# Altium project TIDA-010086_mod.PrjPcb (part 11 of 11)
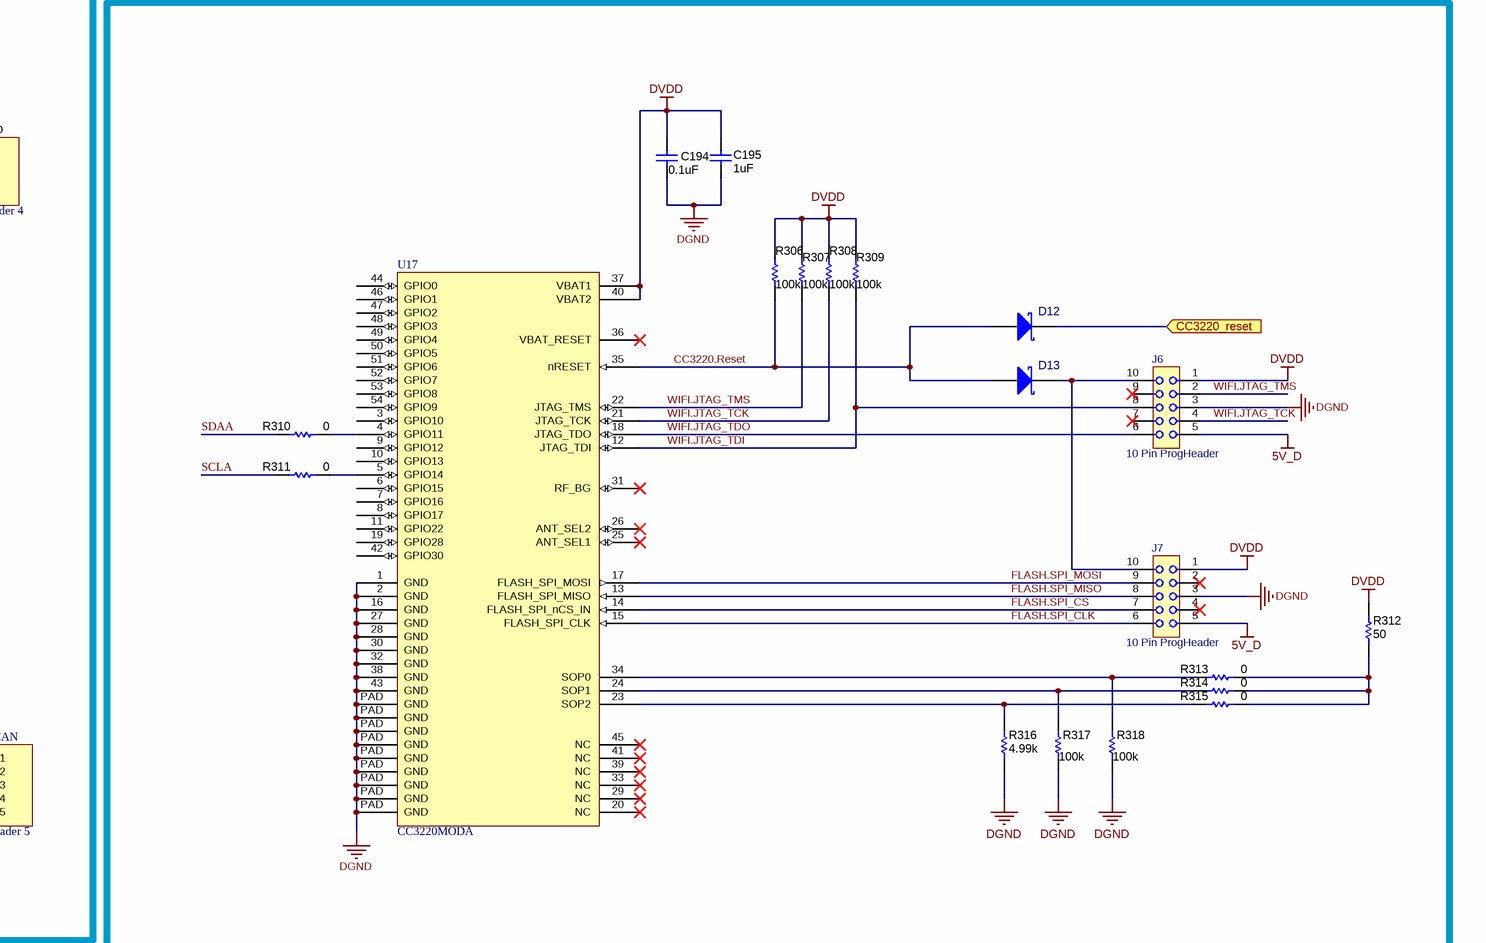
[diagram p119: XTIDA-010086_Control Card_28379.SchDoc, bottom right]

## Sheet XTIDA-010086_CoverSheet.SchDoc: Block diagram
size 431 x 279 mm; Date: Not shown in title block; ApprovedBy: Not shown in title block; CheckedBy: Not shown in title block; Author: Not shown in title block; CompanyName: Not shown in title block; DrawnBy: Jeff Xie; Engineer: Not shown in title block; Organization: Not shown in title block; Address1: Not shown in title block; Address2: Not shown in title block; Address3: Not shown in title block; Address4: Not shown in title block; DocumentNumber: 1; Revision: Use project parameter SCH_Rev; SheetNumber: 1; SheetTotal: 8; PageSetup: Record=PageOptions|CenterHorizontal=True|CenterVertical=True|PrintScale=1.00|XCorrection=1.00|YCorrection=1.00|PrintKind=0|BorderSize=5000000|LeftOffset=0|BottomOffset=0|Orientation=2|PaperLength=1000|PaperWidth=1000|Scale=100|PaperSource=15|PrintQuality=600|MediaType=1|DitherType=10|PaperKind=Letter|PrintScaleMode=1; CurrentTime: Not shown in title block; CurrentDate: Not shown in title block; DocumentFullPathAndName: Not shown in title block; DocumentName: Not shown in title block; ModifiedDate: Not shown in title block; ImagePath: Not shown in title block

### Notes on the sheet
- Drawn By:
- SVN Rev:
- Number:
- TID #:
- Orderable:
- Rev:
- Sheet Title:
- File:
- Project Title:
- Designed for:
- Assembly Variant:
- Mod. Date:
- Sheet:
- Size:
- of
- B
- http://www.ti.com
- Texas Instruments and/or its licensors do not warrant the accuracy or completeness of this specification or any information contained therein. Texas Instruments and/or its licensors do not warrant that this design will meet the specifications, will be suitable for your application or fit for any particular purpose, or will operate in an implementation. Texas Instruments and/or its licensors do not warrant that the design is production worthy. You should completely validate and test your design implementation to confirm the system functionality for your application.
- Engineer:
- Contact:
- © Texas Instruments
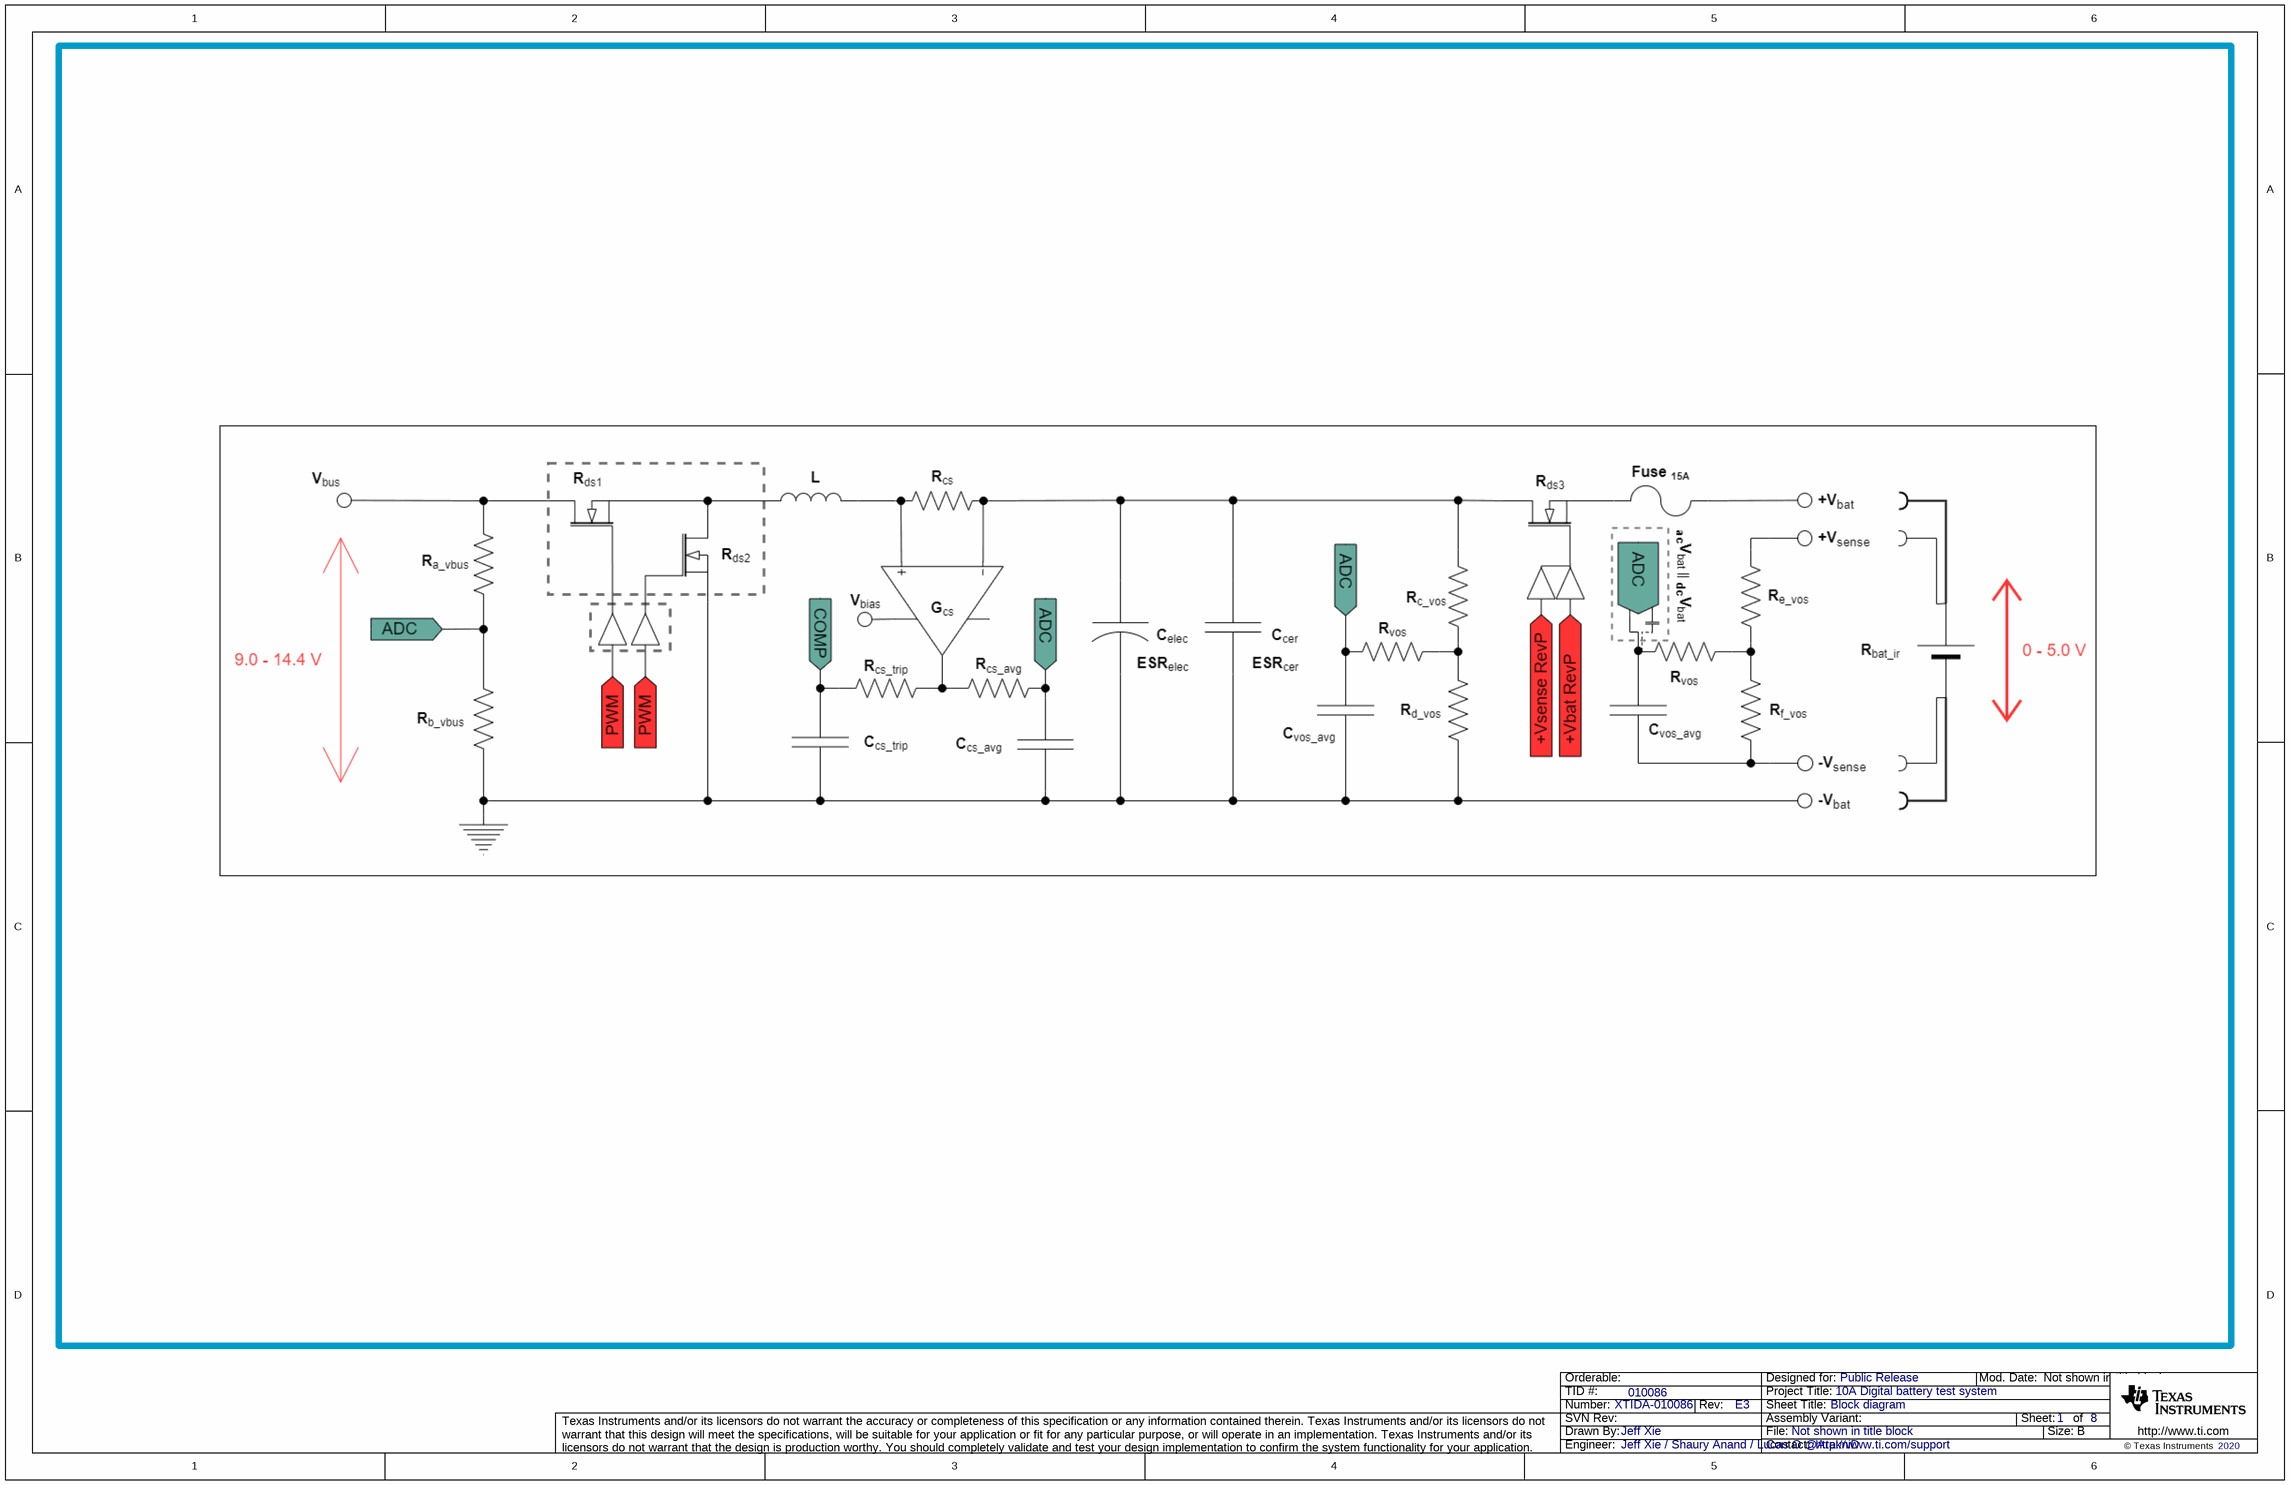
[diagram p18: XTIDA-010086_CoverSheet.SchDoc]

## Sheet XTIDA-010086_Hardware.SchDoc
size 431 x 279 mm; Date: Not shown in title block; ApprovedBy: Not shown in title block; CheckedBy: Not shown in title block; Author: Not shown in title block; CompanyName: Not shown in title block; Engineer: Not shown in title block; Organization: Not shown in title block; Address1: Not shown in title block; Address2: Not shown in title block; Address3: Not shown in title block; Address4: Not shown in title block; DocumentNumber: 3; Revision: Use project parameter SCH_Rev; SheetNumber: 8; SheetTotal: 8; PageSetup: Record=PageOptions|CenterHorizontal=True|CenterVertical=True|PrintScale=1.00|XCorrection=1.00|YCorrection=1.00|PrintKind=0|BorderSize=5000000|LeftOffset=0|BottomOffset=0|Orientation=2|PaperLength=1000|PaperWidth=1000|Scale=100|PaperSource=15|PrintQuality=600|MediaType=1|DitherType=10|PaperKind=Letter|PrintScaleMode=1; CurrentTime: Not shown in title block; CurrentDate: Not shown in title block; Time: Not shown in title block; DocumentFullPathAndName: Not shown in title block; DocumentName: Not shown in title block; ModifiedDate: Not shown in title block; ImagePath: Not shown in title block
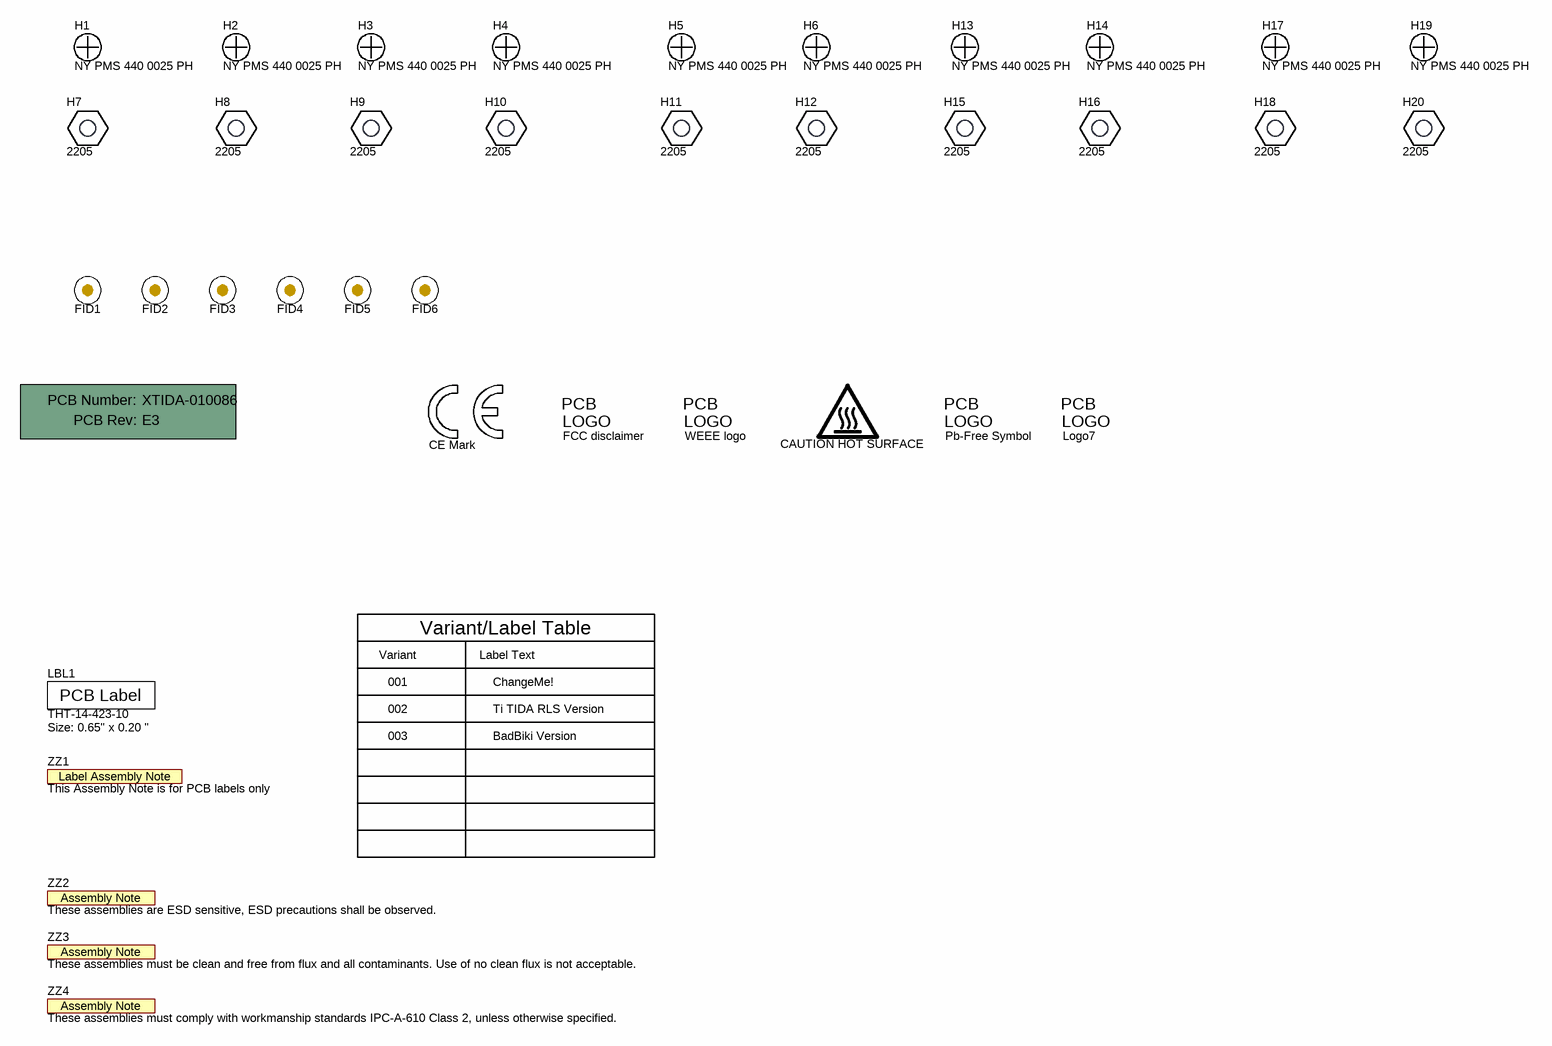
[diagram p19: XTIDA-010086_Hardware.SchDoc]

### Parts
!PCB1  Printed Circuit Board  (value not drawn)  (mechanical)
FID1  Fiducial  [Fiducial10-20]  (value not drawn)
FID2  Fiducial  [Fiducial10-20]  (value not drawn)
FID3  Fiducial  [Fiducial10-20]  (value not drawn)
FID4  Fiducial  [Fiducial10-20]  (value not drawn)
FID5  Fiducial  [Fiducial10-20]  (value not drawn)
FID6  Fiducial  [Fiducial10-20]  (value not drawn)
H1  NY PMS 440 0025 PH  [NY PMS 440 0025 PH]
H2  NY PMS 440 0025 PH  [NY PMS 440 0025 PH]
H3  NY PMS 440 0025 PH  [NY PMS 440 0025 PH]
H4  NY PMS 440 0025 PH  [NY PMS 440 0025 PH]
H5  NY PMS 440 0025 PH  [NY PMS 440 0025 PH]
H6  NY PMS 440 0025 PH  [NY PMS 440 0025 PH]
H7  2205  [KEYSTONE_2205]
H8  2205  [KEYSTONE_2205]
H9  2205  [KEYSTONE_2205]
H10  2205  [KEYSTONE_2205]
H11  2205  [KEYSTONE_2205]
H12  2205  [KEYSTONE_2205]
H13  NY PMS 440 0025 PH  [NY PMS 440 0025 PH]
H14  NY PMS 440 0025 PH  [NY PMS 440 0025 PH]
H15  2205  [KEYSTONE_2205]
H16  2205  [KEYSTONE_2205]
H17  NY PMS 440 0025 PH  [NY PMS 440 0025 PH]
H18  2205  [KEYSTONE_2205]
H19  NY PMS 440 0025 PH  [NY PMS 440 0025 PH]
H20  2205  [KEYSTONE_2205]
LBL1  THT-14-423-10  Note: Size: 0.65" x 0.20 "  [Label_650x200]
Logo1  CE Mark  [CE_Mark_5mm]  (no BOM)
Logo3  FCC disclaimer  [FCC_disclaimer]  (no BOM)
Logo4  WEEE logo  [WEEE_Minimum]  (no BOM)
LOGO5  CAUTION HOT SURFACE  [IEC_HotSurface_Small]  (no BOM)
Logo6  Pb-Free Symbol  [Pb-Free_Overlay_Small]  (no BOM)
Logo7  ESD Susceptible  [ESD_Overlay_Medium]  (value not drawn)  (no BOM)
ZZ1  This Assembly Note is for PCB labels only  [AssemblyNoteLabel]  (no BOM)
ZZ2  These assemblies are ESD sensitive, ESD precautions shall be observed.  [AssemblyNote]  (no BOM)
ZZ3  These assemblies must be clean and free from flux and all contaminants. Use of no clean flux is not acceptable.  [AssemblyNote]  (no BOM)
ZZ4  These assemblies must comply with workmanship standards IPC-A-610 Class 2, unless otherwise specified.  [AssemblyNote]  (no BOM)

### Notes on the sheet
- Variant
- Label Text
- Variant/Label Table
- 001
- 002
- ChangeMe!
- Ti TIDA RLS Version
- 003
- BadBiki Version
- Drawn By:
- SVN Rev:
- Number:
- TID #:
- Orderable:
- Rev:
- Sheet Title:
- File:
- Project Title:
- Designed for:
- Assembly Variant:
- Mod. Date:
- Sheet:
- Size:
- of
- B
- http://www.ti.com
- Texas Instruments and/or its licensors do not warrant the accuracy or completeness of this specification or any information contained therein. Texas Instruments and/or its licensors do not warrant that this design will meet the specifications, will be suitable for your application or fit for any particular purpose, or will operate in an implementation. Texas Instruments and/or its licensors do not warrant that the design is production worthy. You should completely validate and test your design implementation to confirm the system functionality for your application.
- Engineer:
- Contact:
- © Texas Instruments
- (in symbol CMP-0003616-3) Label Assembly Note
- (in symbol CMP-0003618-2) PCB Number:; PCB Rev:
- (in symbol CMP-0003625-1) PCB Label
- (in symbol CMP-0074769-1) PCB; LOGO
- (in symbol CMP-0074847-1) PCB; LOGO
- (in symbol ESD_Susceptible) PCB; LOGO
- (in symbol Pb-Free) PCB; LOGO

### Library data of the parts
!PCB1 = CMP-0003618-2: Manufacturer: Any; PartNumber: XTIDA-010086; CompType: PCB; RoHS: O; MountType: N/A; Publisher: Texas Instruments; LatestRevisionDate: 2017-03-09; Key: PCB
FID1-FID6 = Fiducial: Fiducial mark.  There is nothing to buy or mount.; SymbolCreator: codlsc; SymbolVersion: 2009-11-4; CompType: Fiducial; Publisher: Texas Instruments; LatestRevisionDate: 2014-08-01; LatestRevisionNote: Added Alternate PartNumber and Alternate Manufacturer parameters to appropriate components.; Manufacturer: N/A; MountType: N/A; PackageReference: Fiducial; PartNumber: N/A; ClassName: FiducialMark
H1-H6 H13 H14 H17 H19 = NY PMS 440 0025 PH: Machine Screw, Round, #4-40 x 1/4, Nylon, Philips panhead; Manufacturer: B&F Fastener Supply; CompType: Hardware; SymbolCreator: codlsc; U/M: EA; SymbolVersion: 2009-10-28; MountType: N/A; RoHS: Y; PartNumber: NY PMS 440 0025 PH; PackageReference: Screw; DigiKeyPartNumber: H542-ND; ComponentLink1Description: Datasheet Link; ComponentLink1URL: http://www.fasnetdirect.com/refguide/Machinepancombo.pdf; ClassName: Mounting Holes; Alternate Manufacturer: -; Alternate PartNumber: -; LatestRevisionDate: 2012-06-27; LatestRevisionNote: Initial Version; Publisher: Texas Instruments; Supplier 1: Digi-Key; Supplier Part Number 1: H542-ND
H7-H12 H15 H16 H18 H20 = 2205: Standoff, Hex, 1"L #4-40 Aluminum; Manufacturer: Keystone; SymbolCreator: a0412235; CompType: Standoff; MountType: N/A; RoHS: Y; PartNumber: 2205; PackageReference: 1" Aluminum Hex Standoff; ComponentLink1Description: Datasheet Link; ComponentLink1URL: http://www.keyelco.com/product-pdf.cfm?p=4279; LatestRevisionDate: 2014-11-19; Publisher: Texas Instruments; Supplier 1: Digi-Key; Supplier 2: Mouser; Supplier Part Number 1: 2205K-ND; Supplier Part Number 2: 534-2205; SymbolVersion: 2013-06-24
LBL1 = CMP-0003625-1: Thermal Transfer Printable Labels, 0.650" W x 0.200" H - 10,000 per roll; Manufacturer: Brady; CompType: Label; ClassName: Label; PartNumber: THT-14-423-10; RoHS: Y; PackageReference: PCB Label 0.650 x 0.200 inch; MountType: N/A; ComponentLink1Description: Web Page; ComponentLink1URL: http://www.bradyid.com/bradyid/pdpv/THT-14-423-10.html; Publisher: Texas Instruments; LatestRevisionDate: 2017-03-09; Supplier 1: Newark; Supplier Part Number 1: 97C5133; Supplier 2: Farnell; Supplier Part Number 2: 2065596; Key: THT-14-423-10
Logo1 = CMP-0074844-1: SymbolCreator: a0412235; Published: 2009-03-03; Publisher: Texas Instruments; LatestRevisionDate: 2017-07-06; Lib Reference: CE Mark; PartNumber: CE Mark; Library Reference: CE Mark
Logo3 = CMP-0074847-1: FCC_disclaimer; Library Reference: Logo; Published: 2009-03-03; Publisher: Texas Instruments; LatestRevisionDate: 2017-07-06; Lib Reference: FCC_disclaimer; PartNumber: FCC disclaimer
Logo4 = CMP-0074769-1: Library Reference: WEEE logo; Lib Reference: WEEE logo; PartNumber: WEEE logo
LOGO5 = CMP-0074837-1: IEC 61010-1 Hot Surface Warning; Library Reference: IEC_HotSurface; SymbolCreator: a0412235; Publisher: Texas Instruments; SymbolVersion: 2011-08-22; Published: 2009-03-03; Lib Reference: IEC_HotSurface; LatestRevisionDate: 2017-07-06; PartNumber: CAUTION HOT SURFACE
Logo6 = Pb-Free: SymbolCreator: a0412235; SymbolVersion: 2011-08-22; Published: 2009-03-03; Publisher: Texas Instruments; LatestRevisionDate: 2014-08-05
Logo7 = ESD_Susceptible: ESD Susceptible Symbol; SymbolCreator: a0412235; SymbolVersion: 2011-08-22; Published: 2009-03-03; Publisher: Texas Instruments; LatestRevisionDate: 2016-03-21
ZZ1 = CMP-0003616-3: CompType: AssemblyNote; ClassName: AssemblyNote; Publisher: Texas Instruments; LatestRevisionDate: 2017-03-09; Key: AssemblyNoteLabel
ZZ2 = CMP-0077236-1: CompType: AssemblyNote; ClassName: AssemblyNote; Publisher: Texas Instruments; LatestRevisionDate: 2017-08-10; Key: AssemblyNote
ZZ3 = CMP-0077237-1: CompType: AssemblyNote; ClassName: AssemblyNote; Publisher: Texas Instruments; LatestRevisionDate: 2017-08-10; Key: AssemblyNote
ZZ4 = CMP-0077238-1: CompType: AssemblyNote; ClassName: AssemblyNote; Publisher: Texas Instruments; LatestRevisionDate: 2017-08-10; Key: AssemblyNote

## Nets that join several sheets
5V: XTIDA-010086_ADC (12 pins), XTIDA-010086_Bias Power Supply (5 pins)
5V_D: XTIDA-010086_Bias Power Supply (R163.1 R176.2 R183.1 TP33.1), XTIDA-010086_Control Card_28379 (9 pins)
10V: MAIN SHEET/Ch1 (11 pins), MAIN SHEET/Ch2 (11 pins), MAIN SHEET/Ch3 (11 pins), MAIN SHEET/Ch4 (11 pins), MAIN SHEET/Ch5 (11 pins), MAIN SHEET/Ch6 (11 pins), MAIN SHEET/Ch7 (11 pins), MAIN SHEET/Ch8 (11 pins), XTIDA-010086_Bias Power Supply (10 pins)
10V_Gate: MAIN SHEET/Ch1 (R8_Ch1.2), MAIN SHEET/Ch2 (R8_Ch2.2), MAIN SHEET/Ch3 (R8_Ch3.2), MAIN SHEET/Ch4 (R8_Ch4.2), MAIN SHEET/Ch5 (R8_Ch5.2), MAIN SHEET/Ch6 (R8_Ch6.2), MAIN SHEET/Ch7 (R8_Ch7.2), MAIN SHEET/Ch8 (R8_Ch8.2), XTIDA-010086_Bias Power Supply (8 pins)
12V_Out: XTIDA-010086_MAIN SHEET (6 pins), MAIN SHEET/Ch1 (L1_Ch1.1 TP4_Ch1.1), MAIN SHEET/Ch2 (L1_Ch2.1 TP4_Ch2.1), MAIN SHEET/Ch3 (L1_Ch3.1 TP4_Ch3.1), MAIN SHEET/Ch4 (L1_Ch4.1 TP4_Ch4.1), MAIN SHEET/Ch5 (L1_Ch5.1 TP4_Ch5.1), MAIN SHEET/Ch6 (L1_Ch6.1 TP4_Ch6.1), MAIN SHEET/Ch7 (L1_Ch7.1 TP4_Ch7.1), MAIN SHEET/Ch8 (L1_Ch8.1 TP4_Ch8.1), XTIDA-010086_Bias Power Supply (S3.2), XTIDA-010086_Control Card_28379 (C175.1 R299.1)
-5V: MAIN SHEET/Ch1 (10 pins), MAIN SHEET/Ch2 (10 pins), MAIN SHEET/Ch3 (10 pins), MAIN SHEET/Ch4 (10 pins), MAIN SHEET/Ch5 (10 pins), MAIN SHEET/Ch6 (10 pins), MAIN SHEET/Ch7 (10 pins), MAIN SHEET/Ch8 (10 pins), XTIDA-010086_Bias Power Supply (6 pins)
AGND: MAIN SHEET/Ch1 (40 pins), MAIN SHEET/Ch2 (40 pins), MAIN SHEET/Ch3 (40 pins), MAIN SHEET/Ch4 (40 pins), MAIN SHEET/Ch5 (40 pins), MAIN SHEET/Ch6 (40 pins), MAIN SHEET/Ch7 (40 pins), MAIN SHEET/Ch8 (40 pins), XTIDA-010086_ADC (67 pins), XTIDA-010086_Bias Power Supply (35 pins), XTIDA-010086_Control Card_28379 (7 pins)
AVDD: MAIN SHEET/Ch1 (10 pins), MAIN SHEET/Ch2 (10 pins), MAIN SHEET/Ch3 (10 pins), MAIN SHEET/Ch4 (10 pins), MAIN SHEET/Ch5 (10 pins), MAIN SHEET/Ch6 (10 pins), MAIN SHEET/Ch7 (10 pins), MAIN SHEET/Ch8 (10 pins), XTIDA-010086_ADC (14 pins), XTIDA-010086_Bias Power Supply (5 pins), XTIDA-010086_Control Card_28379 (C176.1 U14.5)
DGND: XTIDA-010086_ADC (32 pins), XTIDA-010086_Bias Power Supply (12 pins), XTIDA-010086_Control Card_28379 (96 pins)
DVDD: XTIDA-010086_ADC (21 pins), XTIDA-010086_Bias Power Supply (6 pins), XTIDA-010086_Control Card_28379 (49 pins)
PGND: XTIDA-010086_MAIN SHEET (10 pins), MAIN SHEET/Ch1 (31 pins), MAIN SHEET/Ch2 (31 pins), MAIN SHEET/Ch3 (31 pins), MAIN SHEET/Ch4 (31 pins), MAIN SHEET/Ch5 (31 pins), MAIN SHEET/Ch6 (31 pins), MAIN SHEET/Ch7 (31 pins), MAIN SHEET/Ch8 (31 pins), XTIDA-010086_ADC (R152.1 R153.2), XTIDA-010086_Bias Power Supply (19 pins)
Vbias_1_25: MAIN SHEET/Ch1 (6 pins), MAIN SHEET/Ch2 (6 pins), MAIN SHEET/Ch3 (6 pins), MAIN SHEET/Ch4 (6 pins), MAIN SHEET/Ch5 (6 pins), MAIN SHEET/Ch6 (6 pins), MAIN SHEET/Ch7 (6 pins), MAIN SHEET/Ch8 (6 pins), XTIDA-010086_ADC (R79.2 TP31.1), XTIDA-010086_Control Card_28379 (R245.1)
Vref_2_50: MAIN SHEET/Ch1 (C183_Ch1.2 RT1_Ch1#1.1 RT1_Ch1#2.1), MAIN SHEET/Ch2 (C183_Ch2.2 RT1_Ch2#1.1 RT1_Ch2#2.1), MAIN SHEET/Ch3 (C183_Ch3.2 RT1_Ch3#1.1 RT1_Ch3#2.1), MAIN SHEET/Ch4 (C183_Ch4.2 RT1_Ch4#1.1 RT1_Ch4#2.1), MAIN SHEET/Ch5 (C183_Ch5.2 RT1_Ch5#1.1 RT1_Ch5#2.1), MAIN SHEET/Ch6 (C183_Ch6.2 RT1_Ch6#1.1 RT1_Ch6#2.1), MAIN SHEET/Ch7 (C183_Ch7.2 RT1_Ch7#1.1 RT1_Ch7#2.1), MAIN SHEET/Ch8 (C183_Ch8.2 RT1_Ch8#1.1 RT1_Ch8#2.1), XTIDA-010086_ADC (R457.2 TP45.1)
B+: MAIN SHEET/Ch1 (C52_Ch1.1 R10_Ch1.1 R44_Ch1.2 R64_Ch1.1), MAIN SHEET/Ch2 (C52_Ch2.1 R10_Ch2.1 R44_Ch2.2 R64_Ch2.1), MAIN SHEET/Ch3 (C52_Ch3.1 R10_Ch3.1 R44_Ch3.2 R64_Ch3.1), MAIN SHEET/Ch4 (C52_Ch4.1 R10_Ch4.1 R44_Ch4.2 R64_Ch4.1), MAIN SHEET/Ch5 (C52_Ch5.1 R10_Ch5.1 R44_Ch5.2 R64_Ch5.1), MAIN SHEET/Ch6 (C52_Ch6.1 R10_Ch6.1 R44_Ch6.2 R64_Ch6.1), MAIN SHEET/Ch7 (C52_Ch7.1 R10_Ch7.1 R44_Ch7.2 R64_Ch7.1), MAIN SHEET/Ch8 (C52_Ch8.1 R10_Ch8.1 R44_Ch8.2 R64_Ch8.1)
B-: MAIN SHEET/Ch1 (R20_Ch1.2 R70_Ch1.1), MAIN SHEET/Ch2 (R20_Ch2.2 R70_Ch2.1), MAIN SHEET/Ch3 (R20_Ch3.2 R70_Ch3.1), MAIN SHEET/Ch4 (R20_Ch4.2 R70_Ch4.1), MAIN SHEET/Ch5 (R20_Ch5.2 R70_Ch5.1), MAIN SHEET/Ch6 (R20_Ch6.2 R70_Ch6.1), MAIN SHEET/Ch7 (R20_Ch7.2 R70_Ch7.1), MAIN SHEET/Ch8 (R20_Ch8.2 R70_Ch8.1)
CS1: XTIDA-010086_ADC (R108.1 R112.2 TP16.1), XTIDA-010086_Control Card_28379 (R282.2)
CS2: XTIDA-010086_ADC (R139.1 R143.2 TP22.1), XTIDA-010086_Control Card_28379 (R285.2)
CS+: MAIN SHEET/Ch1 (R12_Ch1.1 R29_Ch1.1), MAIN SHEET/Ch2 (R12_Ch2.1 R29_Ch2.1), MAIN SHEET/Ch3 (R12_Ch3.1 R29_Ch3.1), MAIN SHEET/Ch4 (R12_Ch4.1 R29_Ch4.1), MAIN SHEET/Ch5 (R12_Ch5.1 R29_Ch5.1), MAIN SHEET/Ch6 (R12_Ch6.1 R29_Ch6.1), MAIN SHEET/Ch7 (R12_Ch7.1 R29_Ch7.1), MAIN SHEET/Ch8 (R12_Ch8.1 R29_Ch8.1)
CS-: MAIN SHEET/Ch1 (R13_Ch1.1 R28_Ch1.1), MAIN SHEET/Ch2 (R13_Ch2.1 R28_Ch2.1), MAIN SHEET/Ch3 (R13_Ch3.1 R28_Ch3.1), MAIN SHEET/Ch4 (R13_Ch4.1 R28_Ch4.1), MAIN SHEET/Ch5 (R13_Ch5.1 R28_Ch5.1), MAIN SHEET/Ch6 (R13_Ch6.1 R28_Ch6.1), MAIN SHEET/Ch7 (R13_Ch7.1 R28_Ch7.1), MAIN SHEET/Ch8 (R13_Ch8.1 R28_Ch8.1)
DIN1: XTIDA-010086_ADC (R102.2 TP12.1), XTIDA-010086_Control Card_28379 (R277.1)
DIN2: XTIDA-010086_ADC (R133.2 TP18.1), XTIDA-010086_Control Card_28379 (R298.1)
DOUT1: XTIDA-010086_ADC (R105.2 TP13.1), XTIDA-010086_Control Card_28379 (R279.1)
DOUT2: XTIDA-010086_ADC (R136.2 TP19.1), XTIDA-010086_Control Card_28379 (R286.1)
DRDY1: XTIDA-010086_ADC (R110.2 TP15.1), XTIDA-010086_Control Card_28379 (R272.2)
DRDY2: XTIDA-010086_ADC (R141.2 TP21.1), XTIDA-010086_Control Card_28379 (R297.1)
DRDY3: XTIDA-010086_ADC (R167.1 R170.2), XTIDA-010086_Control Card_28379 (R296.2)
DRDY4: XTIDA-010086_ADC (R42.1 R192.2), XTIDA-010086_Control Card_28379 (R222.2)
EPWM_A: MAIN SHEET/Ch1 (R2_Ch1.2), MAIN SHEET/Ch2 (R2_Ch2.2), MAIN SHEET/Ch3 (R2_Ch3.2), MAIN SHEET/Ch4 (R2_Ch4.2), MAIN SHEET/Ch5 (R2_Ch5.2), MAIN SHEET/Ch6 (R2_Ch6.2), MAIN SHEET/Ch7 (R2_Ch7.2), MAIN SHEET/Ch8 (R2_Ch8.2)
EPWM_B: MAIN SHEET/Ch1 (R3_Ch1.2), MAIN SHEET/Ch2 (R3_Ch2.2), MAIN SHEET/Ch3 (R3_Ch3.2), MAIN SHEET/Ch4 (R3_Ch4.2), MAIN SHEET/Ch5 (R3_Ch5.2), MAIN SHEET/Ch6 (R3_Ch6.2), MAIN SHEET/Ch7 (R3_Ch7.2), MAIN SHEET/Ch8 (R3_Ch8.2)
H-Drive: MAIN SHEET/Ch1 (D3_Ch1.1 R11_Ch1.2 U1_Ch1.7), MAIN SHEET/Ch2 (D3_Ch2.1 R11_Ch2.2 U1_Ch2.7), MAIN SHEET/Ch3 (D3_Ch3.1 R11_Ch3.2 U1_Ch3.7), MAIN SHEET/Ch4 (D3_Ch4.1 R11_Ch4.2 U1_Ch4.7), MAIN SHEET/Ch5 (D3_Ch5.1 R11_Ch5.2 U1_Ch5.7), MAIN SHEET/Ch6 (D3_Ch6.1 R11_Ch6.2 U1_Ch6.7), MAIN SHEET/Ch7 (D3_Ch7.1 R11_Ch7.2 U1_Ch7.7), MAIN SHEET/Ch8 (D3_Ch8.1 R11_Ch8.2 U1_Ch8.7)
HDrive: MAIN SHEET/Ch1 (Q1_Ch1.4 R11_Ch1.1 R18_Ch1.2 R19_Ch1.2), MAIN SHEET/Ch2 (Q1_Ch2.4 R11_Ch2.1 R18_Ch2.2 R19_Ch2.2), MAIN SHEET/Ch3 (Q1_Ch3.4 R11_Ch3.1 R18_Ch3.2 R19_Ch3.2), MAIN SHEET/Ch4 (Q1_Ch4.4 R11_Ch4.1 R18_Ch4.2 R19_Ch4.2), MAIN SHEET/Ch5 (Q1_Ch5.4 R11_Ch5.1 R18_Ch5.2 R19_Ch5.2), MAIN SHEET/Ch6 (Q1_Ch6.4 R11_Ch6.1 R18_Ch6.2 R19_Ch6.2), MAIN SHEET/Ch7 (Q1_Ch7.4 R11_Ch7.1 R18_Ch7.2 R19_Ch7.2), MAIN SHEET/Ch8 (Q1_Ch8.4 R11_Ch8.1 R18_Ch8.2 R19_Ch8.2)
IoutN: MAIN SHEET/Ch1 (C28_Ch1.2 R40_Ch1.1 TP8_Ch1.1), MAIN SHEET/Ch2 (C28_Ch2.2 R40_Ch2.1 TP8_Ch2.1), MAIN SHEET/Ch3 (C28_Ch3.2 R40_Ch3.1 TP8_Ch3.1), MAIN SHEET/Ch4 (C28_Ch4.2 R40_Ch4.1 TP8_Ch4.1), MAIN SHEET/Ch5 (C28_Ch5.2 R40_Ch5.1 TP8_Ch5.1), MAIN SHEET/Ch6 (C28_Ch6.2 R40_Ch6.1 TP8_Ch6.1), MAIN SHEET/Ch7 (C28_Ch7.2 R40_Ch7.1 TP8_Ch7.1), MAIN SHEET/Ch8 (C28_Ch8.2 R40_Ch8.1 TP8_Ch8.1)
IoutP: MAIN SHEET/Ch1 (C28_Ch1.1 R36_Ch1.2 TP7_Ch1.1), MAIN SHEET/Ch2 (C28_Ch2.1 R36_Ch2.2 TP7_Ch2.1), MAIN SHEET/Ch3 (C28_Ch3.1 R36_Ch3.2 TP7_Ch3.1), MAIN SHEET/Ch4 (C28_Ch4.1 R36_Ch4.2 TP7_Ch4.1), MAIN SHEET/Ch5 (C28_Ch5.1 R36_Ch5.2 TP7_Ch5.1), MAIN SHEET/Ch6 (C28_Ch6.1 R36_Ch6.2 TP7_Ch6.1), MAIN SHEET/Ch7 (C28_Ch7.1 R36_Ch7.2 TP7_Ch7.1), MAIN SHEET/Ch8 (C28_Ch8.1 R36_Ch8.2 TP7_Ch8.1)
IoutS: MAIN SHEET/Ch1 (C17_Ch1.1 R31_Ch1.2 TP43_Ch1.1), MAIN SHEET/Ch2 (C17_Ch2.1 R31_Ch2.2 TP43_Ch2.1), MAIN SHEET/Ch3 (C17_Ch3.1 R31_Ch3.2 TP43_Ch3.1), MAIN SHEET/Ch4 (C17_Ch4.1 R31_Ch4.2 TP43_Ch4.1), MAIN SHEET/Ch5 (C17_Ch5.1 R31_Ch5.2 TP43_Ch5.1), MAIN SHEET/Ch6 (C17_Ch6.1 R31_Ch6.2 TP43_Ch6.1), MAIN SHEET/Ch7 (C17_Ch7.1 R31_Ch7.2 TP43_Ch7.1), MAIN SHEET/Ch8 (C17_Ch8.1 R31_Ch8.2 TP43_Ch8.1)
L-Drive: MAIN SHEET/Ch1 (D4_Ch1.1 R21_Ch1.2 U1_Ch1.5), MAIN SHEET/Ch2 (D4_Ch2.1 R21_Ch2.2 U1_Ch2.5), MAIN SHEET/Ch3 (D4_Ch3.1 R21_Ch3.2 U1_Ch3.5), MAIN SHEET/Ch4 (D4_Ch4.1 R21_Ch4.2 U1_Ch4.5), MAIN SHEET/Ch5 (D4_Ch5.1 R21_Ch5.2 U1_Ch5.5), MAIN SHEET/Ch6 (D4_Ch6.1 R21_Ch6.2 U1_Ch6.5), MAIN SHEET/Ch7 (D4_Ch7.1 R21_Ch7.2 U1_Ch7.5), MAIN SHEET/Ch8 (D4_Ch8.1 R21_Ch8.2 U1_Ch8.5)
LDrive: MAIN SHEET/Ch1 (Q7_Ch1.4 R21_Ch1.1 R24_Ch1.2 R25_Ch1.2), MAIN SHEET/Ch2 (Q7_Ch2.4 R21_Ch2.1 R24_Ch2.2 R25_Ch2.2), MAIN SHEET/Ch3 (Q7_Ch3.4 R21_Ch3.1 R24_Ch3.2 R25_Ch3.2), MAIN SHEET/Ch4 (Q7_Ch4.4 R21_Ch4.1 R24_Ch4.2 R25_Ch4.2), MAIN SHEET/Ch5 (Q7_Ch5.4 R21_Ch5.1 R24_Ch5.2 R25_Ch5.2), MAIN SHEET/Ch6 (Q7_Ch6.4 R21_Ch6.1 R24_Ch6.2 R25_Ch6.2), MAIN SHEET/Ch7 (Q7_Ch7.4 R21_Ch7.1 R24_Ch7.2 R25_Ch7.2), MAIN SHEET/Ch8 (Q7_Ch8.4 R21_Ch8.1 R24_Ch8.2 R25_Ch8.2)
PDrive: MAIN SHEET/Ch1 (R7_Ch1.1 R62_Ch1.1 R75_Ch1.2), MAIN SHEET/Ch2 (R7_Ch2.1 R62_Ch2.1 R75_Ch2.2), MAIN SHEET/Ch3 (R7_Ch3.1 R62_Ch3.1 R75_Ch3.2), MAIN SHEET/Ch4 (R7_Ch4.1 R62_Ch4.1 R75_Ch4.2), MAIN SHEET/Ch5 (R7_Ch5.1 R62_Ch5.1 R75_Ch5.2), MAIN SHEET/Ch6 (R7_Ch6.1 R62_Ch6.1 R75_Ch6.2), MAIN SHEET/Ch7 (R7_Ch7.1 R62_Ch7.1 R75_Ch7.2), MAIN SHEET/Ch8 (R7_Ch8.1 R62_Ch8.1 R75_Ch8.2)
RESET1: XTIDA-010086_ADC (6 pins), XTIDA-010086_Control Card_28379 (R284.1)
RESET2: XTIDA-010086_ADC (6 pins), XTIDA-010086_Control Card_28379 (R239.1)
RP_GATE_DRV: MAIN SHEET/Ch1 (D35_Ch1.1 R62_Ch1.2 R76_Ch1.1 U4_Ch1.7), MAIN SHEET/Ch2 (D35_Ch2.1 R62_Ch2.2 R76_Ch2.1 U4_Ch2.7), MAIN SHEET/Ch3 (D35_Ch3.1 R62_Ch3.2 R76_Ch3.1 U4_Ch3.7), MAIN SHEET/Ch4 (D35_Ch4.1 R62_Ch4.2 R76_Ch4.1 U4_Ch4.7), MAIN SHEET/Ch5 (D35_Ch5.1 R62_Ch5.2 R76_Ch5.1 U4_Ch5.7), MAIN SHEET/Ch6 (D35_Ch6.1 R62_Ch6.2 R76_Ch6.1 U4_Ch6.7), MAIN SHEET/Ch7 (D35_Ch7.1 R62_Ch7.2 R76_Ch7.1 U4_Ch7.7), MAIN SHEET/Ch8 (D35_Ch8.1 R62_Ch8.2 R76_Ch8.1 U4_Ch8.7)
SCLK1: XTIDA-010086_ADC (R106.2 TP14.1), XTIDA-010086_Control Card_28379 (R280.2)
SCLK2: XTIDA-010086_ADC (R137.2 TP20.1), XTIDA-010086_Control Card_28379 (R288.1)
SW: MAIN SHEET/Ch1 (16 pins), MAIN SHEET/Ch2 (16 pins), MAIN SHEET/Ch3 (16 pins), MAIN SHEET/Ch4 (16 pins), MAIN SHEET/Ch5 (16 pins), MAIN SHEET/Ch6 (16 pins), MAIN SHEET/Ch7 (16 pins), MAIN SHEET/Ch8 (16 pins)
TemP: MAIN SHEET/Ch1 (C184_Ch1.1 R219_Ch1.2 TP44_Ch1.1), MAIN SHEET/Ch2 (C184_Ch2.1 R219_Ch2.2 TP44_Ch2.1), MAIN SHEET/Ch3 (C184_Ch3.1 R219_Ch3.2 TP44_Ch3.1), MAIN SHEET/Ch4 (C184_Ch4.1 R219_Ch4.2 TP44_Ch4.1), MAIN SHEET/Ch5 (C184_Ch5.1 R219_Ch5.2 TP44_Ch5.1), MAIN SHEET/Ch6 (C184_Ch6.1 R219_Ch6.2 TP44_Ch6.1), MAIN SHEET/Ch7 (C184_Ch7.1 R219_Ch7.2 TP44_Ch7.1), MAIN SHEET/Ch8 (C184_Ch8.1 R219_Ch8.2 TP44_Ch8.1)
V+: MAIN SHEET/Ch1 (R14_Ch1.1 R45_Ch1.2 R291_Ch1.2), MAIN SHEET/Ch2 (R14_Ch2.1 R45_Ch2.2 R291_Ch2.2), MAIN SHEET/Ch3 (R14_Ch3.1 R45_Ch3.2 R291_Ch3.2), MAIN SHEET/Ch4 (R14_Ch4.1 R45_Ch4.2 R291_Ch4.2), MAIN SHEET/Ch5 (R14_Ch5.1 R45_Ch5.2 R291_Ch5.2), MAIN SHEET/Ch6 (R14_Ch6.1 R45_Ch6.2 R291_Ch6.2), MAIN SHEET/Ch7 (R14_Ch7.1 R45_Ch7.2 R291_Ch7.2), MAIN SHEET/Ch8 (R14_Ch8.1 R45_Ch8.2 R291_Ch8.2)
V-: MAIN SHEET/Ch1 (R16_Ch1.2 R17_Ch1.1), MAIN SHEET/Ch2 (R16_Ch2.2 R17_Ch2.1), MAIN SHEET/Ch3 (R16_Ch3.2 R17_Ch3.1), MAIN SHEET/Ch4 (R16_Ch4.2 R17_Ch4.1), MAIN SHEET/Ch5 (R16_Ch5.2 R17_Ch5.1), MAIN SHEET/Ch6 (R16_Ch6.2 R17_Ch6.1), MAIN SHEET/Ch7 (R16_Ch7.2 R17_Ch7.1), MAIN SHEET/Ch8 (R16_Ch8.2 R17_Ch8.1)
VoutN: MAIN SHEET/Ch1 (C40_Ch1.2 R74_Ch1.1 TP10_Ch1.1), MAIN SHEET/Ch2 (C40_Ch2.2 R74_Ch2.1 TP10_Ch2.1), MAIN SHEET/Ch3 (C40_Ch3.2 R74_Ch3.1 TP10_Ch3.1), MAIN SHEET/Ch4 (C40_Ch4.2 R74_Ch4.1 TP10_Ch4.1), MAIN SHEET/Ch5 (C40_Ch5.2 R74_Ch5.1 TP10_Ch5.1), MAIN SHEET/Ch6 (C40_Ch6.2 R74_Ch6.1 TP10_Ch6.1), MAIN SHEET/Ch7 (C40_Ch7.2 R74_Ch7.1 TP10_Ch7.1), MAIN SHEET/Ch8 (C40_Ch8.2 R74_Ch8.1 TP10_Ch8.1)
VoutP: MAIN SHEET/Ch1 (C40_Ch1.1 R68_Ch1.2 TP9_Ch1.1), MAIN SHEET/Ch2 (C40_Ch2.1 R68_Ch2.2 TP9_Ch2.1), MAIN SHEET/Ch3 (C40_Ch3.1 R68_Ch3.2 TP9_Ch3.1), MAIN SHEET/Ch4 (C40_Ch4.1 R68_Ch4.2 TP9_Ch4.1), MAIN SHEET/Ch5 (C40_Ch5.1 R68_Ch5.2 TP9_Ch5.1), MAIN SHEET/Ch6 (C40_Ch6.1 R68_Ch6.2 TP9_Ch6.1), MAIN SHEET/Ch7 (C40_Ch7.1 R68_Ch7.2 TP9_Ch7.1), MAIN SHEET/Ch8 (C40_Ch8.1 R68_Ch8.2 TP9_Ch8.1)
VoutS: MAIN SHEET/Ch1 (C37_Ch1.2 R39_Ch1.2 TP42_Ch1.1), MAIN SHEET/Ch2 (C37_Ch2.2 R39_Ch2.2 TP42_Ch2.1), MAIN SHEET/Ch3 (C37_Ch3.2 R39_Ch3.2 TP42_Ch3.1), MAIN SHEET/Ch4 (C37_Ch4.2 R39_Ch4.2 TP42_Ch4.1), MAIN SHEET/Ch5 (C37_Ch5.2 R39_Ch5.2 TP42_Ch5.1), MAIN SHEET/Ch6 (C37_Ch6.2 R39_Ch6.2 TP42_Ch6.1), MAIN SHEET/Ch7 (C37_Ch7.2 R39_Ch7.2 TP42_Ch7.1), MAIN SHEET/Ch8 (C37_Ch8.2 R39_Ch8.2 TP42_Ch8.1)

## Assembly variants
001: not fitted !PCB1 C2_Ch1 C2_Ch2 C2_Ch3 C2_Ch4 C2_Ch5 C2_Ch6 C2_Ch7 C2_Ch8 C16_Ch1 C16_Ch2 C16_Ch3 C16_Ch4 C16_Ch5 C16_Ch6 C16_Ch7 C16_Ch8 C17_Ch1 C17_Ch2 C17_Ch3 C17_Ch4 C17_Ch5 C17_Ch6 C17_Ch7 C17_Ch8 C21_Ch1 C21_Ch2 C21_Ch3 C21_Ch4 C21_Ch5 C21_Ch6 C21_Ch7 C21_Ch8 C22_Ch1 C22_Ch2 C22_Ch3 C22_Ch4 C22_Ch5 C22_Ch6 C22_Ch7 C22_Ch8 C28_Ch1 C28_Ch2 C28_Ch3 C28_Ch4 C28_Ch5 C28_Ch6 C28_Ch7 C28_Ch8 C37_Ch1 C37_Ch2 C37_Ch3 C37_Ch4 C37_Ch5 C37_Ch6 C37_Ch7 C37_Ch8 C40_Ch1 C40_Ch2 C40_Ch3 C40_Ch4 C40_Ch5 C40_Ch6 C40_Ch7 C40_Ch8 C64 C85 C148 C149 C171_Ch1 C171_Ch2 C171_Ch3 C171_Ch4 C171_Ch5 C171_Ch6 C171_Ch7 C171_Ch8 C172_Ch1 C172_Ch2 C172_Ch3 C172_Ch4 C172_Ch5 C172_Ch6 C172_Ch7 C172_Ch8 D12 FID1 FID2 FID3 FID4 FID5 FID6 H1 H2 H3 H4 H5 H6 H7 H8 H9 H10 H11 H12 H13 H14 H15 H16 H17 H18 H19 H20 J6 J7 LBL1 P1 P2 R4_Ch1 R4_Ch2 R4_Ch3 R4_Ch4 R4_Ch5 R4_Ch6 R4_Ch7 R4_Ch8 R22 R26 R48 R50 R58 R97 R98 R128 R129 R188 R189 R203 R246 R248 R290_Ch1 R290_Ch2 R290_Ch3 R290_Ch4 R290_Ch5 R290_Ch6 R290_Ch7 R290_Ch8 R307 R308 R309 R313 R314 SH-J4 U39 Y1 Y2 ZZ1 ZZ2 ZZ3 ZZ4